# EAGLE schematic BMC1a (EAGLE 7.5.0)
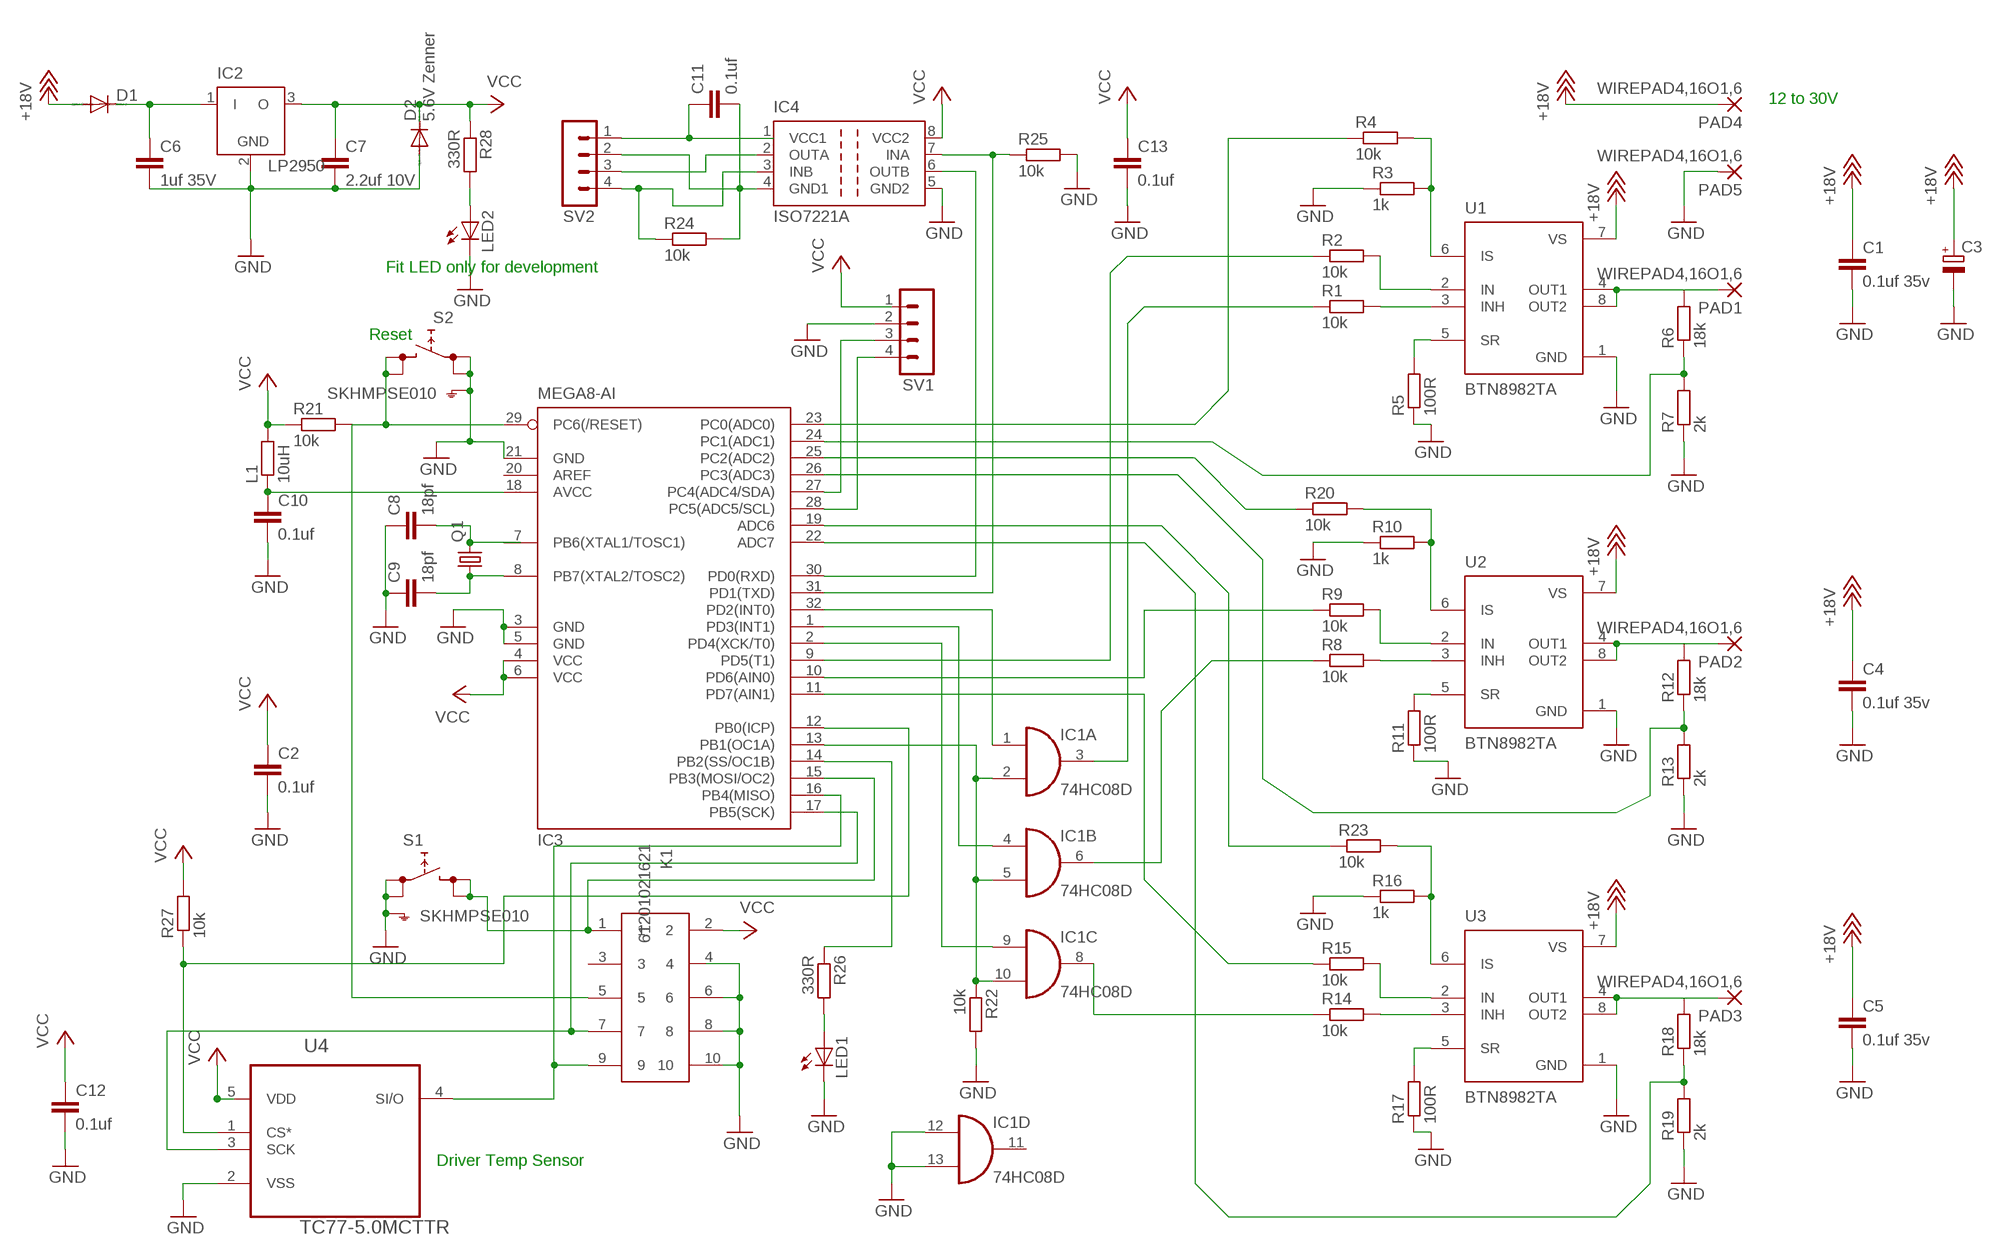
[diagram p0: schematic, sheet 1]

## Parts
C1  0.1uf 35v  C-EUC0805  [C0805]
C2  0.1uf  C-EUC0805  [C0805]
C3  CPOL-EUUD-10X10  [UD-10X10_NICHICON]
C4  0.1uf 35v  C-EUC0805  [C0805]
C5  0.1uf 35v  C-EUC0805  [C0805]
C6  1uf 35V  C-EUC0805  [C0805]
C7  2.2uf 10V  C-EUC0805  [C0805]
C8  18pf  C-EUC0805  [C0805]
C9  18pf  C-EUC0805  [C0805]
C10  0.1uf  C-EUC0805  [C0805]
C11  0.1uf  C-EUC0805  [C0805]
C12  0.1uf  C-EUC0805  [C0805]
C13  0.1uf  C-EUC0805  [C0805]
D1  DIODE-SMB  [SMB]
D2  5.6V Zenner  DIODE-DO214AA  [DO214AA]
IC1  74HC08D  [SO14]
IC2  LP2950  [DPACK]
IC3  MEGA8-AI  [TQFP32-08]
IC4  ISO7221A  [SO-08]
K1  61201021621  [61201021621]
L1  10uH  R-EU_R0805  [R0805]
LED1  LEDCHIPLED_0805  [CHIPLED_0805]
LED2  LEDCHIPLED_0805  [CHIPLED_0805]
PAD1  WIREPAD4,16O1,6  [4,16O1,6]
PAD2  WIREPAD4,16O1,6  [4,16O1,6]
PAD3  WIREPAD4,16O1,6  [4,16O1,6]
PAD4  WIREPAD4,16O1,6  [4,16O1,6]
PAD5  WIREPAD4,16O1,6  [4,16O1,6]
Q1  CRYSTALHC49S  [HC49/S]
R1  10k  R-EU_R0805  [R0805]
R2  10k  R-EU_R0805  [R0805]
R3  1k  R-EU_R0805  [R0805]
R4  10k  R-EU_R0805  [R0805]
R5  100R  R-EU_R0805  [R0805]
R6  18k  R-EU_R0805  [R0805]
R7  2k  R-EU_R0805  [R0805]
R8  10k  R-EU_R0805  [R0805]
R9  10k  R-EU_R0805  [R0805]
R10  1k  R-EU_R0805  [R0805]
R11  100R  R-EU_R0805  [R0805]
R12  18k  R-EU_R0805  [R0805]
R13  2k  R-EU_R0805  [R0805]
R14  10k  R-EU_R0805  [R0805]
R15  10k  R-EU_R0805  [R0805]
R16  1k  R-EU_R0805  [R0805]
R17  100R  R-EU_R0805  [R0805]
R18  18k  R-EU_R0805  [R0805]
R19  2k  R-EU_R0805  [R0805]
R20  10k  R-EU_R0805  [R0805]
R21  10k  R-EU_R0805  [R0805]
R22  10k  R-EU_R0805  [R0805]
R23  10k  R-EU_R0805  [R0805]
R24  10k  R-EU_R0805  [R0805]
R25  10k  R-EU_R0805  [R0805]
R26  330R  R-EU_R0805  [R0805]
R27  10k  R-EU_R0805  [R0805]
R28  330R  R-EU_R0805  [R0805]
S1  SKHMPSE010  [SKHMPXE010]
S2  SKHMPSE010  [SKHMPXE010]
SV1  MA04-1  [MA04-1]
SV2  MA04-1  [MA04-1]
U1  BTN8982TA  [TO127P1500X440-8N-1]
U2  BTN8982TA  [TO127P1500X440-8N-1]
U3  BTN8982TA  [TO127P1500X440-8N-1]
U4  TC77-5.0MCTTR  [SOT95P290X145-5N]

## Nets
+18V: C1.1 C3.+ C4.1 C5.1 D1.A PAD4.1(P) U1.7(VS) U2.7(VS) U3.7(VS)
GND: C1.2 C2.2 C3.- C4.2 C5.2 C6.2 C7.2 C8.1 C9.1 C10.2 C12.2 C13.2 D2.A IC1.12(D:I0) IC1.13(D:I1) IC2.2(GND) IC3.3(GND) IC3.5(GND) IC3.21(GND) IC4.5(GND2) K1.6 K1.8 K1.10 LED1.C LED2.C PAD5.1(P) R3.1 R5.1 R7.1 R10.1 R11.1 R13.1 R16.1 R17.1 R19.1 R22.2 R25.2 S1.1(1.1) S1.2(1.2) S1.5(SH) S2.1(1.1) S2.2(1.2) S2.5(SH) SV1.2 U1.1(GND) U2.1(GND) U3.1(GND) U4.2(VSS)
N$1: R5.2 U1.5(SR)
N$2: PAD1.1(P) R6.2 U1.4(OUT1) U1.8(OUT2)
N$3: R1.2 U1.3(INH)
N$4: R2.2 U1.2(IN)
N$5: IC3.23(PC0(ADC0)) R4.1
N$6: IC3.24(PC1(ADC1)) R6.1 R7.2
N$7: PAD2.1(P) R12.2 U2.4(OUT1) U2.8(OUT2)
N$8: R11.2 U2.5(SR)
N$9: R8.2 U2.3(INH)
N$10: R9.2 U2.2(IN)
N$11: IC3.25(PC2(ADC2)) R20.1
N$12: IC1.8(C:O) R14.1
N$13: PAD3.1(P) R18.2 U3.4(OUT1) U3.8(OUT2)
N$14: R17.2 U3.5(SR)
N$15: R14.2 U3.3(INH)
N$16: R15.2 U3.2(IN)
N$17: IC3.19(ADC6)
N$18: IC3.22(ADC7) R18.1 R19.2
N$19: IC1.6(B:O) R8.1
N$20: IC1.3(A:O) R1.1
N$21: IC3.9(PD5(T1)) R2.1
N$22: IC3.26(PC3(ADC3)) R12.1 R13.2
N$23: IC3.10(PD6(AIN0)) R9.1
N$24: R15.1
N$25: IC1.2(A:I1) IC1.5(B:I1) IC1.10(C:I1) IC3.13(PB1(OC1A)) R22.1
N$26: C6.1 D1.C IC2.1(I)
N$27: C8.2 Q1.2
N$28: IC1.1(A:I0) IC3.32(PD2(INT0))
N$29: IC1.4(B:I0) IC3.1(PD3(INT1))
N$30: IC1.9(C:I0) IC3.2(PD4(XCK/T0))
N$31: C9.2 IC3.8(PB7(XTAL2/TOSC2)) Q1.1
N$32: IC3.15(PB3(MOSI/OC2)) K1.1 S1.3(2.1) S1.4(2.2)
N$34: IC3.17(PB5(SCK)) K1.7 U4.3(SCK)
N$35: IC3.16(PB4(MISO)) K1.9 U4.4(SI/O)
N$36: R10.2 R20.2 U2.6(IS)
N$37: IC3.27(PC4(ADC4/SDA)) SV1.3
N$38: R3.2 R4.2 U1.6(IS)
N$39: R16.2 R23.2 U3.6(IS)
N$40: C10.1 IC3.18(AVCC) L1.1
N$41: IC3.28(PC5(ADC5/SCL)) SV1.4
N$42: IC3.30(PD0(RXD)) IC4.6(OUTB)
N$43: IC3.31(PD1(TXD)) IC4.7(INA) R25.1
N$44: C11.1 SV2.1
N$45: C11.2 IC4.4(GND1) R24.2 SV2.2
N$46: IC4.2(OUTA) SV2.3
N$47: IC4.3(INB) R24.1 SV2.4
N$48: LED1.A R26.2
N$49: IC3.14(PB2(SS/OC1B)) R26.1
N$50: IC3.12(PB0(ICP)) R27.1 U4.1(CS*)
N$51: LED2.A R28.2
N$52: IC3.29(PC6(/RESET)) K1.5 R21.2 S2.3(2.1) S2.4(2.2)
VCC: C2.1 C7.1 C12.1 C13.1 D2.C IC2.3(O) IC3.4(VCC) IC3.6(VCC) IC4.8(VCC2) K1.2 L1.2 R21.1 R27.2 R28.1 SV1.1 U4.5(VDD)
Unconnected: IC1.11(D:O) IC3.7(PB6(XTAL1/TOSC1)) IC3.11(PD7(AIN1)) IC3.20(AREF) K1.3 K1.4 R23.1

## Notes on the sheet
- 12 to 30V
- Fit LED only for development
- Reset
- Driver Temp Sensor

## Power pins joined to a net without a drawn wire
GND: IC1.7(P:GND)
VCC: IC1.14(P:VCC)
VCC1: IC4.1(VCC1)

## Library data of the parts
C1 C2 C4-C13 = rcl:C-EU: CAPACITOR, European symbol
C3 = rcl:CPOL-EU: POLARIZED CAPACITOR, European symbol
D1 D2 = diode:DIODE-: DIODE
IC1 = 74xx-eu:74*08: Quad 2-input AND gate
IC2 = linear:LP2950: 100 mA, Low Power Low Dropout Voltage Regulator Source: http://www.onsemi.com/pub/Collateral/LP2950-D.PDF
IC3 = atmel:MEGA8: MICROCONTROLLER 8 Kbytes FLASH, 1 kbytes SRAM, 512 bytes EEPROM, USART, 6-channel 10 bit ADC, 2-channel 8 bit ADC Pin compatible with Atmega48, ATMega88, ATMega168 Source: avr.lbr; MPN: ATMEGA8-16AU; OC_FARNELL: 9171371; OC_NEWARK: 73M8863
IC4 = texas:ISO7221: DUAL DIGITAL ISOLATORS Source: http://focus.ti.com/lit/ds/symlink/iso7221a.pdf; MPN: ISO7221AD; OC_FARNELL: 1390651; OC_NEWARK: 48M0672
K1 = Wire_to_Board_Connectors_rev15d:61201021621: WR-BHD 2.54mm Male Box Header, 10 Pins=>Code : Con_WTB_BHD_2.54_Male_THT_WS_61201021621 <http://katalog.we-online.de/media/thumbs2/eican/thb_Con_WTB_BHD_2.54_Male_THT_WS_6120xx21621_pf2.jpg> Details see: http://katalog.we-online.de/en/em/612_0xx_216_21 Created 2014-06-04, Karrer Zheng 2014 (C) Würth Elektronik
L1 R1-R28 = resistor:R-EU_: RESISTOR, European symbol
LED1 LED2 = led:LED: LED OSRAM: - CHIPLED LG R971, LG N971, LY N971, LG Q971, LY Q971, LO R971, LY R971 LH N974, LH R974 LS Q976, LO Q976, LY Q976 LO Q996 - Hyper CHIPLED LW Q18S LB Q993, LB Q99A, LB R99A - SideLED LS A670, LO A670, LY A670, LG A670, LP A670 LB A673, LV A673, LT A673, LW A673 LH A674 LY A675 LS A676, LA A676, LO A676, LY A676, LW A676 LS A679, LY A679, LG A679 - Hyper Micro SIDELED® LS Y876, LA Y876, LO Y876, LY Y876 LT Y87S - SmartLED LW L88C, LW L88S LB L89C, LB L89S, LG L890 LS L89K, LO L89K, LY L89K LS L896, LA L896, LO L896, LY L896 - TOPLED LS T670, LO T670, LY T670, LG T670, LP T670 LSG T670, LSP T670, LSY T670, LOP T670, LYG T670 LG T671, LOG T671, LSG T671 LB T673, LV T673, LT T673, LW T673 LH T674 LS T676, LA T676, LO T676, LY T676, LB T676, LH T676, LSB T676, LW T676 LB T67C, LV T67C, LT T67C, LS T67K, LO T67K, LY T67K, LW E67C LS E67B, LA E67B, LO E67B, LY E67B, LB E67C, LV E67C, LT E67C LW T67C LS T679, LY T679, LG T679 LS T770, LO T770, LY T770, LG T770, LP T770 LB T773, LV T773, LT T773, LW T773 LH T774 LS E675, LA E675, LY E675, LS T675 LS T776, LA T776, LO T776, LY T776, LB T776 LHGB T686 LT T68C, LB T68C - Hyper Mini TOPLED® LB M676 - Mini TOPLED Santana® LG M470 LS M47K, LO M47K, LY M47K Source: http://www.osram.convergy.de LUXEON: - LUMILED® LXK2-PW12-R00, LXK2-PW12-S00, LXK2-PW14-U00, LXK2-PW14-V00 LXK2-PM12-R00, LXK2-PM12-S00, LXK2-PM14-U00 LXK2-PE12-Q00, LXK2-PE12-R00, LXK2-PE12-S00, LXK2-PE14-T00, LXK2-PE14-U00 LXK2-PB12-K00, LXK2-PB12-L00, LXK2-PB12-M00, LXK2-PB14-N00, LXK2-PB14-P00, LXK2-PB14-Q00 LXK2-PR12-L00, LXK2-PR12-M00, LXK2-PR14-Q00, LXK2-PR14-R00 LXK2-PD12-Q00, LXK2-PD12-R00, LXK2-PD12-S00 LXK2-PH12-R00, LXK2-PH12-S00 LXK2-PL12-P00, LXK2-PL12-Q00, LXK2-PL12-R00 Source: www.luxeon.com KINGBRIGHT: KA-3528ASYC Source: www.kingbright.com
PAD1-PAD5 = wirepad:WIREPAD: Wire PAD connect wire on PCB
Q1 = crystal:CRYSTAL: CRYSTAL; OC_FARNELL: 1667008; OC_NEWARK: unknown
S1 S2 = switch:SKHMP*E010: 6.2 X 6.5mm TACT Switch (SMD) Source: http://www3.alps.co.jp/WebObjects/catalog.woa/PDF/E/Switch/Tact/SKHM/SKHM.PDF
SV1 SV2 = con-lstb:MA04-1: PIN HEADER; OC_FARNELL: unknown; OC_NEWARK: unknown
U1-U3 = BTN8982TA:BTN8982TA: BTN8982TA High Current PN Half Bridge NovalithIC TO127P1500X440-8N-1
U4 = temp-tc77-5v:TC77-5.0MCTTR: IC,Thermal Sensor with SPI Interface ,5.0V, SOT23-5; MPN: TC77-5.0MCTTR; OC_FARNELL: 1292291; OC_NEWARK: 96K4049; PACKAGE: SOT23-5; SUPPLIER: Microchip

## Net classes
0 default: width 0.305 mm